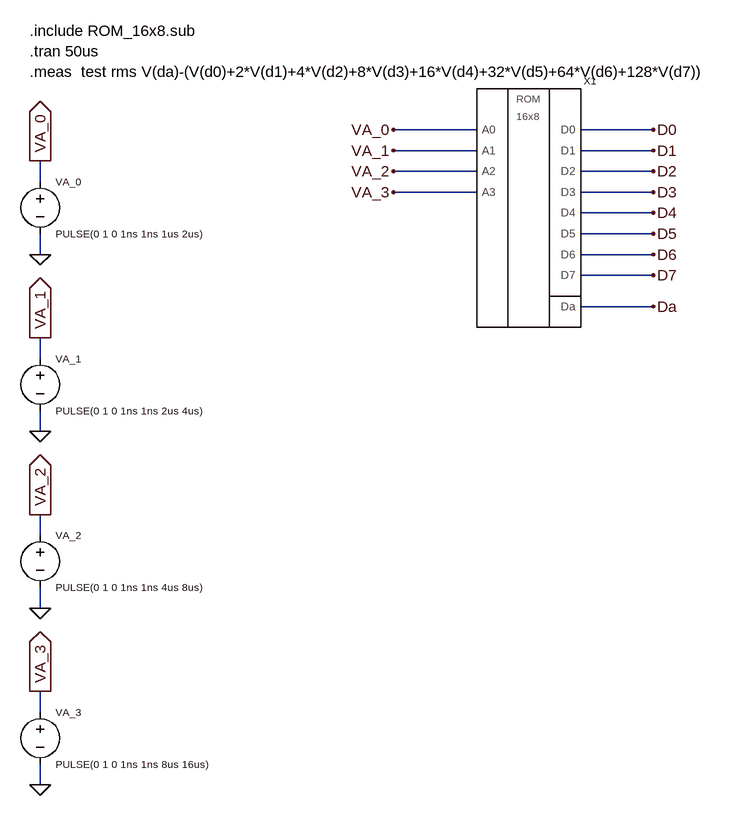
[diagram p0: schematic test1.asc]
test1.asc, the LTspice schematic file:
Version 4
SHEET 1 1200 680
WIRE -160 -384 -288 -384
WIRE 112 -384 0 -384
WIRE -160 -352 -288 -352
WIRE 112 -352 0 -352
WIRE -160 -320 -288 -320
WIRE 112 -320 0 -320
WIRE -832 -304 -832 -336
WIRE -160 -288 -288 -288
WIRE 112 -288 0 -288
WIRE 112 -256 0 -256
WIRE 112 -224 0 -224
WIRE -832 -192 -832 -224
WIRE 112 -192 0 -192
WIRE 112 -160 0 -160
WIRE 112 -112 0 -112
WIRE -832 -32 -832 -64
WIRE -832 80 -832 48
WIRE -832 240 -832 208
WIRE -832 352 -832 320
WIRE -832 512 -832 480
WIRE -832 624 -832 592
FLAG -832 -192 0
FLAG -832 -336 VA_0
IOPIN -832 -336 Out
FLAG 112 -384 D0
FLAG 112 -352 D1
FLAG 112 -112 Da
FLAG -832 80 0
FLAG -832 -64 VA_1
IOPIN -832 -64 Out
FLAG -832 352 0
FLAG -832 208 VA_2
IOPIN -832 208 Out
FLAG -832 624 0
FLAG -832 480 VA_3
IOPIN -832 480 Out
FLAG -288 -384 VA_0
FLAG -288 -352 VA_1
FLAG -288 -320 VA_2
FLAG -288 -288 VA_3
FLAG 112 -320 D2
FLAG 112 -288 D3
FLAG 112 -256 D4
FLAG 112 -224 D5
FLAG 112 -192 D6
FLAG 112 -160 D7
SYMBOL voltage -832 -320 R0
WINDOW 123 0 0 Left 0
WINDOW 39 24 124 Left 2
WINDOW 0 24 16 Left 1
WINDOW 3 24 96 Left 1
SYMATTR InstName VA_0
SYMATTR Value PULSE(0 1 0 1ns 1ns 1us 2us)
SYMBOL ROM_16x8 -80 -288 R0
SYMATTR InstName X1
SYMATTR Prefix X
SYMATTR Value ROM_16x8
SYMBOL voltage -832 -48 R0
WINDOW 123 0 0 Left 0
WINDOW 39 24 124 Left 2
WINDOW 0 24 16 Left 1
WINDOW 3 24 96 Left 1
SYMATTR InstName VA_1
SYMATTR Value PULSE(0 1 0 1ns 1ns 2us 4us)
SYMBOL voltage -832 224 R0
WINDOW 123 0 0 Left 0
WINDOW 39 24 124 Left 2
WINDOW 0 24 16 Left 1
WINDOW 3 24 96 Left 1
SYMATTR InstName VA_2
SYMATTR Value PULSE(0 1 0 1ns 1ns 4us 8us)
SYMBOL voltage -832 496 R0
WINDOW 123 0 0 Left 0
WINDOW 39 24 124 Left 2
WINDOW 0 24 16 Left 1
WINDOW 3 24 96 Left 1
SYMATTR InstName VA_3
SYMATTR Value PULSE(0 1 0 1ns 1ns 8us 16us)
TEXT -848 -536 Left 2 !.include ROM_16x8.sub\n.tran 50us\n.meas  test rms V(da)-(V(d0)+2*V(d1)+4*V(d2)+8*V(d3)+16*V(d4)+32*V(d5)+64*V(d6)+128*V(d7))

The netlist it stands for:
* test1.asc
VA_0 VA_0 0 PULSE(0 1 0 1ns 1ns 1us 2us)
XX1 VA_0 VA_1 VA_2 VA_3 D0 D1 D2 D3 D4 D5 D6 D7 Da ROM_16x8 params: ROM_16x8  ; pins A0 A1 A2 A3 D0 D1 D2 D3 D4 D5 D6 D7 Da
VA_1 VA_1 0 PULSE(0 1 0 1ns 1ns 2us 4us)
VA_2 VA_2 0 PULSE(0 1 0 1ns 1ns 4us 8us)
VA_3 VA_3 0 PULSE(0 1 0 1ns 1ns 8us 16us)
.include ROM_16x8.sub
.tran 50us
.meas  test rms V(da)-(V(d0)+2*V(d1)+4*V(d2)+8*V(d3)+16*V(d4)+32*V(d5)+64*V(d6)+128*V(d7))
.backanno
.end